# EAGLE design Un_SecUSB (EAGLE 7.1.0)
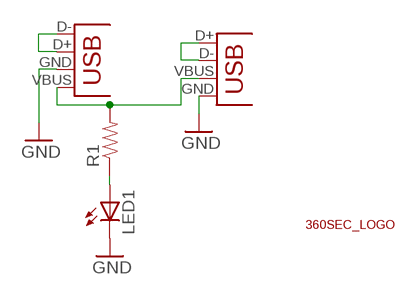
[diagram p0: schematic, sheet 1]

## Parts
LED1  LED0603  [LED-0603]
R1  RESISTOR0603-RES  [0603-RES]
U$3  360SEC_LOGO_0.8  [360SEC_0.8]
X1  USB_4-A-H  [USB-A-H]
X2  USB_4_1  [USB-A-1]

## Nets
GND: LED1.C X1.GND(VBUS) X2.GND
N$1: R1.2 X1.VBUS(GND) X2.VBUS
N$2: X1.D+(D-) X1.D-(D+)
N$3: X2.D+ X2.D-
N$4: LED1.A R1.1

## Library data of the parts
LED1 = 2SparkFun:LED: LEDs Standard schematic elements and footprints for 5mm, 3mm, 1206, and 0603 sized LEDs. 5mm - Spark Fun Electronics SKU : COM-00529 (and others)
R1 = 2SparkFun:RESISTOR: Resistor Basic schematic elements and footprints for 0603, 1206, and PTH resistors.
U$3 = 2SparkFun:360SEC_LOGO
X1 X2 = 2SparkFun:USB_4: USB Connectors USB-B-PTH is fully proven SKU : PRT-00139 USB-miniB is fully proven SKU : PRT-00587 USB-A-PCB is untested. USB-A-H is throughly reviewed, but untested. Spark Fun Electronics SKU : PRT-00437 USB-B-SMT is throughly reviewed, but untested. Needs silkscreen touching up. USB-A-S has not been used/tested USB-MB-H has not been used/tested

## Board
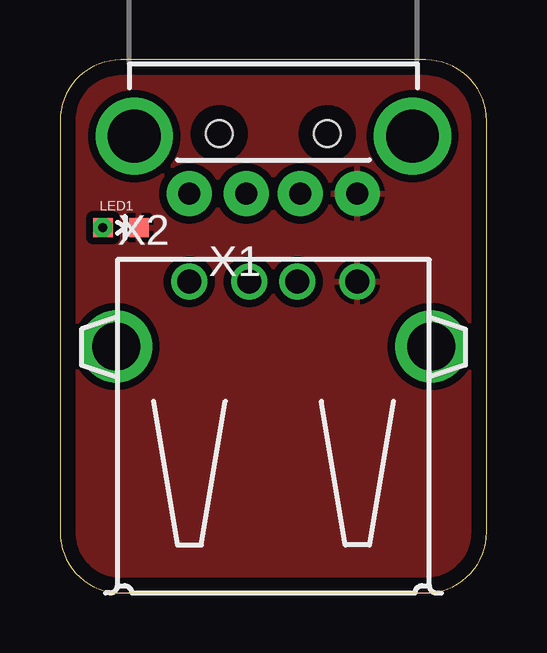
[diagram p1: board, top side]
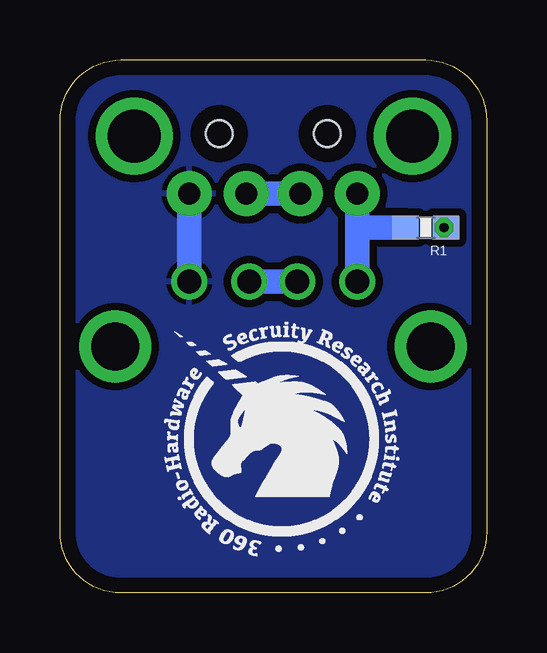
[diagram p2: board, bottom side, seen from below]

Size 17.78 x 22.23 mm. Coordinates in mm from the lower left corner, seen from the top.
Outline: 0,19.69 0,2.54 arc90 2.54,0 15.24,0 arc90 17.78,2.54 17.78,19.69 arc90 15.24,22.23 2.54,22.23 arc90 0,19.69
Copper layers (1*16): Top 0.035mm / dielectric 1.5mm / Bottom 0.035mm
Design rules "yun": minimum track width 8mil, minimum drill 15mil, track to track 8mil, track to pad 8mil, pad to pad 8mil, via to via 8mil, smd to smd 8mil, copper to edge 25mil, drill to drill 8mil, minimum pad ring 10mil, minimum via ring 8mil, stop-mask expansion 4mil, vias tented up to drill 20mil, thermal gap 8mil

### Footprints (pad centres in the part's own frame; a part is rotated, then mirrored left to right if it is on the bottom)
LED-0603 = smd 0.8 x 0.8: A 0,-0.75; C 0,0.75
0603-RES = smd 1.1 x 1: 1 -0.85,0; 2 0.85,0
USB-A-H = drill 0.914 pad 1.88: D+ 2.4,1.127; D- 2.4,-1.127; GND 2.4,3.5; VBUS 2.4,-3.5 | drill 2.2: GND2 0,-5.8; GND3 0,5.8 | hole 1.1: -0.1,2.25; -0.1,-2.25
USB-A-1 = drill 1: D+ 1,4.1; D- -1,4.1; GND 3.5,4.1; VBUS -3.5,4.1 | drill 2: GND@1 6.579,1.388; GND@2 -6.553,1.388

### Placement (x,y rotation side)
LED1  2.54,15.24 270 top
R1  2.54,15.24 180 bottom
U$3  13.97,1.27 0 bottom
X1  8.89,19.05 270 top
X2  8.89,8.89 0 top

### Tracks (layer width: path | path; a pad name or v marks a point on that pad's centre or on a via)
GND
  Bottom 1.016: X1.GND X2.GND | X2.GND
  pour Bottom (isolate 0.305, rank 2): 0,22.23 0,0 17.78,0 17.78,22.23
  pour Top (isolate 0.305, rank 2): 17.78,22.23 0,22.23 0,0 17.78,0
N$1
  Bottom 1.016: X1.VBUS 5.39,15.24 | 5.39,15.24 X2.VBUS | X2.VBUS | R1.2 5.39,15.24
N$2
  Bottom 1.016: X1.D+ X1.D-
N$3
  Bottom 1.016: X2.D+ X2.D-
N$4  (via drill 0.38)
  Top 0.406: LED1.A v1.78,15.24
  Bottom 0.406: v1.78,15.24 R1.1

### Text on the board
bDocu: SecUSB V1.0